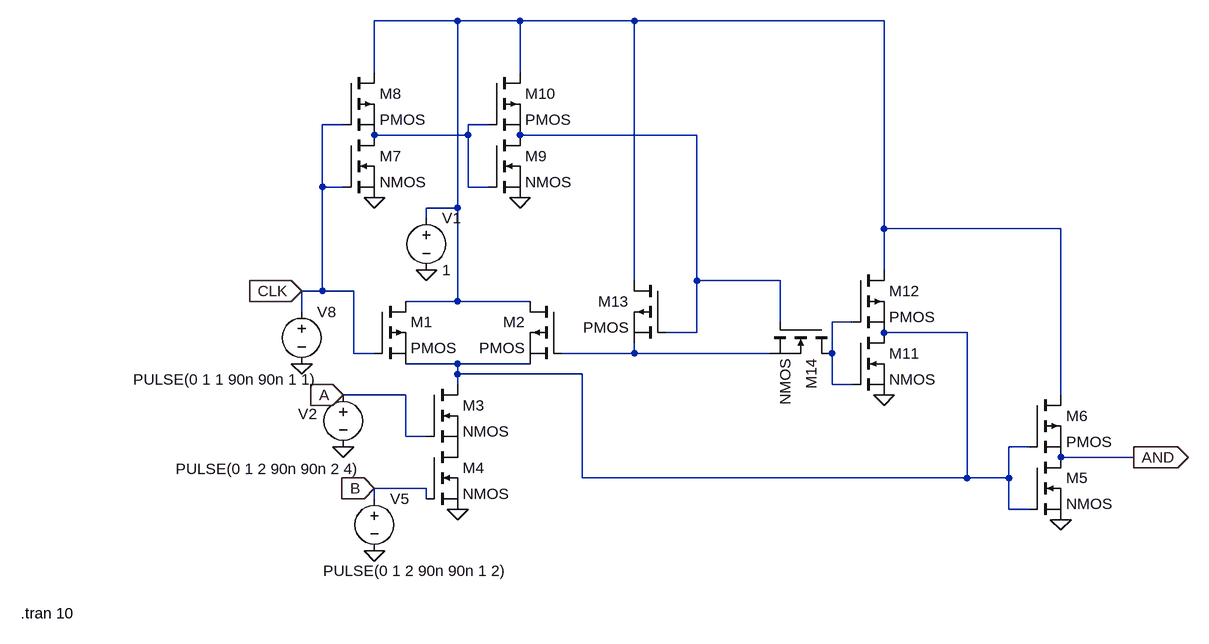
[diagram p0: schematic Draft3.asc]
Draft3.asc, the LTspice schematic file:
Version 4
SHEET 1 1588 680
WIRE 192 -368 64 -368
WIRE 288 -368 192 -368
WIRE 464 -368 288 -368
WIRE 848 -368 464 -368
WIRE 64 -288 64 -368
WIRE 288 -288 288 -368
WIRE 16 -208 -16 -208
WIRE 240 -208 208 -208
WIRE 208 -192 208 -208
WIRE 208 -192 64 -192
WIRE 560 -192 288 -192
WIRE -16 -112 -16 -208
WIRE 16 -112 -16 -112
WIRE 208 -112 208 -192
WIRE 240 -112 208 -112
WIRE 192 -80 192 -368
WIRE 192 -80 144 -80
WIRE 144 -64 144 -80
WIRE 848 -48 848 -368
WIRE 1120 -48 848 -48
WIRE 848 16 848 -48
WIRE 464 32 464 -368
WIRE 560 32 560 -192
WIRE 688 32 560 32
WIRE -16 48 -16 -112
WIRE -16 48 -48 48
WIRE 32 48 -16 48
WIRE 192 64 192 -80
WIRE 192 64 112 64
WIRE 304 64 192 64
WIRE -48 80 -48 48
WIRE 688 96 688 32
WIRE 800 96 768 96
WIRE 560 112 560 32
WIRE 560 112 512 112
WIRE 976 112 848 112
WIRE 32 144 32 48
WIRE 64 144 32 144
WIRE 464 144 464 128
WIRE 464 144 352 144
WIRE 672 144 464 144
WIRE 768 144 768 96
WIRE 192 160 112 160
WIRE 304 160 192 160
WIRE 192 176 192 160
WIRE 384 176 192 176
WIRE 192 192 192 176
WIRE 768 192 768 144
WIRE 800 192 768 192
WIRE 112 208 16 208
WIRE 1120 208 1120 -48
WIRE 112 272 112 208
WIRE 144 272 112 272
WIRE 1072 288 1040 288
WIRE 1232 304 1120 304
WIRE 384 336 384 176
WIRE 976 336 976 112
WIRE 976 336 384 336
WIRE 1040 336 1040 288
WIRE 1040 336 976 336
WIRE 144 352 64 352
WIRE 64 368 64 352
WIRE 144 368 144 352
WIRE 1040 384 1040 336
WIRE 1072 384 1040 384
FLAG 192 384 0
FLAG 144 16 0
FLAG 16 288 0
FLAG 64 448 0
FLAG 1120 400 0
FLAG 64 -96 0
FLAG 288 -96 0
FLAG 848 208 0
FLAG -48 160 0
FLAG -48 48 CLK
IOPIN -48 48 In
FLAG 16 208 A
IOPIN 16 208 In
FLAG 64 352 B
IOPIN 64 352 In
FLAG 1232 304 AND
IOPIN 1232 304 Out
SYMBOL pmos 64 64 R0
SYMATTR InstName M1
SYMBOL pmos 352 64 M0
SYMATTR InstName M2
SYMBOL nmos 144 192 R0
SYMATTR InstName M3
SYMBOL nmos 144 288 R0
SYMATTR InstName M4
SYMBOL voltage 144 -80 R0
WINDOW 123 0 0 Left 0
WINDOW 39 0 0 Left 0
SYMATTR InstName V1
SYMATTR Value 1
SYMBOL voltage 16 192 R0
WINDOW 0 -69 45 Left 2
WINDOW 3 -258 130 Left 2
WINDOW 123 0 0 Left 0
WINDOW 39 0 0 Left 0
SYMATTR InstName V2
SYMATTR Value PULSE(0 1 2 90n 90n 2 4)
SYMBOL voltage 64 352 R0
WINDOW 3 -79 127 Left 2
WINDOW 123 0 0 Left 0
WINDOW 39 0 0 Left 0
SYMATTR Value PULSE(0 1 2 90n 90n 1 2)
SYMATTR InstName V5
SYMBOL nmos 1072 304 R0
SYMATTR InstName M5
SYMBOL pmos 1072 208 R0
SYMATTR InstName M6
SYMBOL nmos 16 -192 R0
SYMATTR InstName M7
SYMBOL pmos 16 -288 R0
SYMATTR InstName M8
SYMBOL nmos 240 -192 R0
SYMATTR InstName M9
SYMBOL pmos 240 -288 R0
SYMATTR InstName M10
SYMBOL nmos 800 112 R0
SYMATTR InstName M11
SYMBOL pmos 800 16 R0
SYMATTR InstName M12
SYMBOL voltage -48 64 R0
WINDOW 3 -259 120 Left 2
WINDOW 123 0 0 Left 0
WINDOW 39 0 0 Left 0
SYMATTR Value PULSE(0 1 1 90n 90n 1 1)
SYMATTR InstName V8
SYMBOL pmos 512 32 M0
SYMATTR InstName M13
SYMBOL nmos 768 96 R90
SYMATTR InstName M14
TEXT -480 544 Left 2 !.tran 10

The netlist it stands for:
* Draft3.asc
M1 N001 CLK N005 N005 PMOS
M2 N001 N006 N005 N005 PMOS
M3 N005 A P001 P001 NMOS
M4 P001 B 0 0 NMOS
V1 N001 0 1
V2 A 0 PULSE(0 1 2 90n 90n 2 4)
V5 B 0 PULSE(0 1 2 90n 90n 1 2)
M5 AND N005 0 0 NMOS
M6 N001 N005 AND AND PMOS
M7 N002 CLK 0 0 NMOS
M8 N001 CLK N002 N002 PMOS
M9 N003 N002 0 0 NMOS
M10 N001 N002 N003 N003 PMOS
M11 N005 N004 0 0 NMOS
M12 N001 N004 N005 N005 PMOS
V8 CLK 0 PULSE(0 1 1 90n 90n 1 1)
M13 N001 N003 N006 N006 PMOS
M14 N004 N003 N006 N006 NMOS
.model NMOS NMOS
.model PMOS PMOS
.lib standard.mos
.tran 10
.backanno
.end